# Altium project modFOC-MCU.PrjPcb
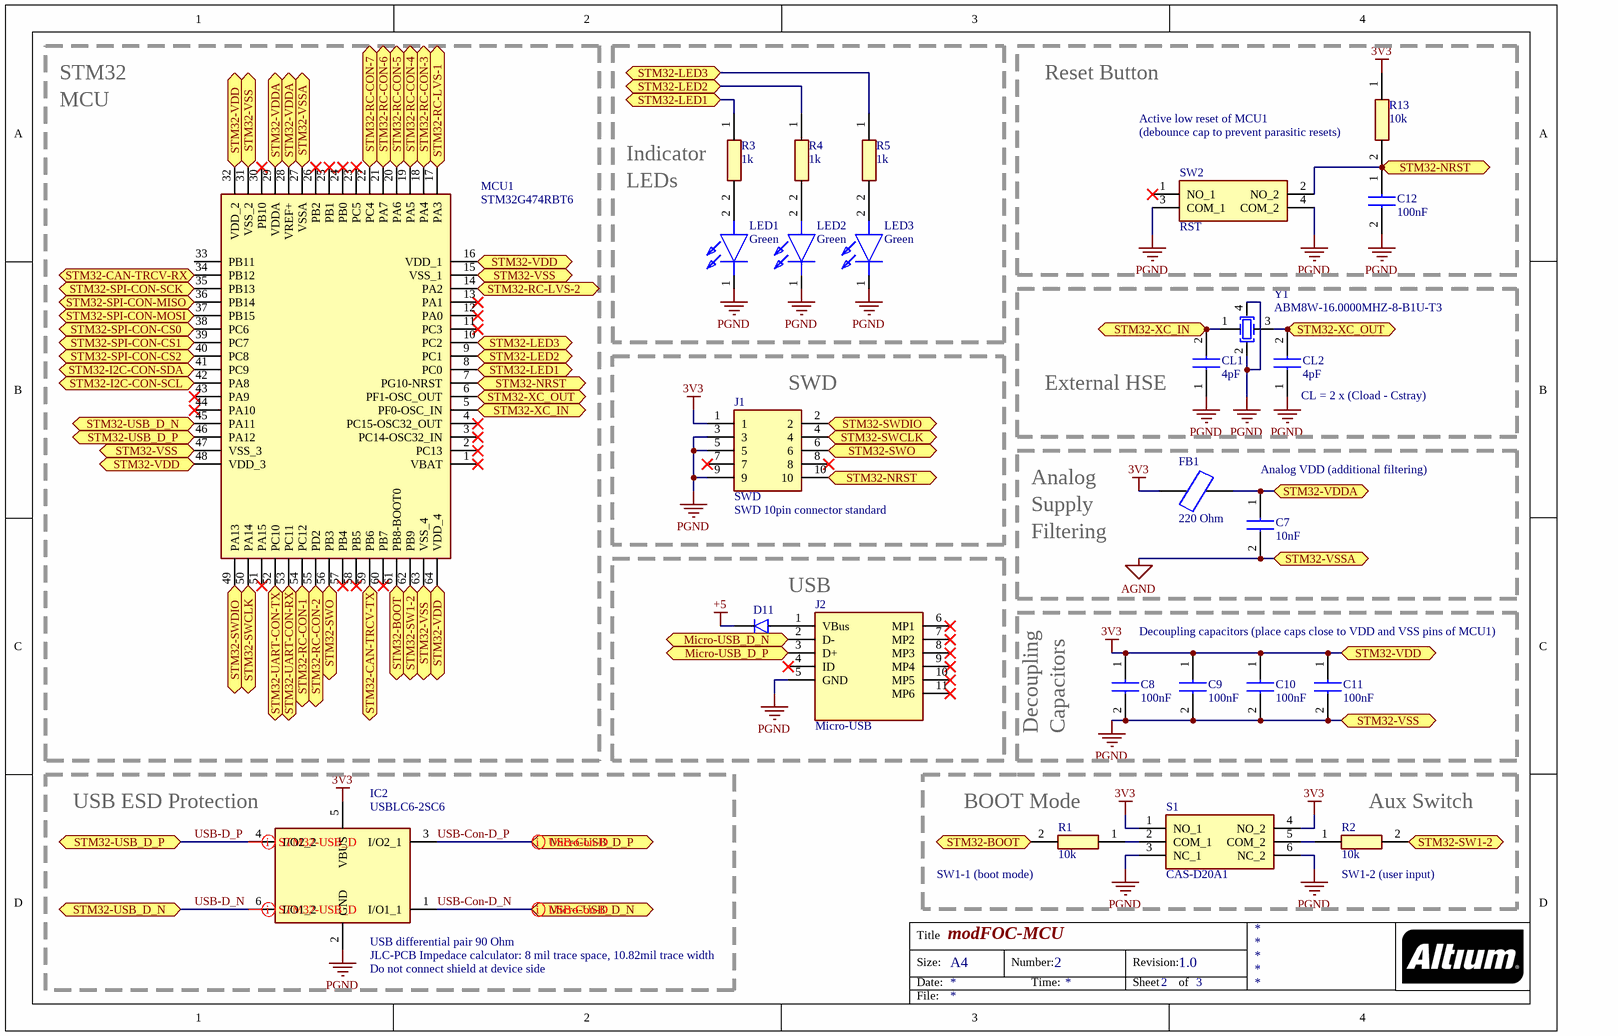
[diagram p0: modFOC-MCU.SchDoc]
3 sheets, 54 parts. Net scope: flat (ports and power ports of the same name join across sheets).
Board file: modFOC-MCU.PcbDoc
Sheets:
  modFOC-MCU.SchDoc
  modFOC-Power_Module.SchDoc
  modFOC-IO.SchDoc

## Sheet modFOC-MCU.SchDoc: modFOC-MCU
size A4; Author: Thomas Hofmann; DocumentNumber: 2; Revision: 1.0; SheetNumber: 2; SheetTotal: 3

### Parts
C7  10nF  [CAPC2012X88N]
C8  100nF  [CAPC1608X97N]
C9  100nF  [CAPC1608X97N]
C10  100nF  [CAPC1608X97N]
C11  100nF  [CAPC1608X97N]
C12  100nF  [CAPC1608X97N]
CL1  4pF  [CAPC1608X90N]
CL2  4pF  [CAPC1608X90N]
D11  BAS3010A03WE6327HTSA1  [SOD2513X110N]  (value not drawn)
FB1  220 Ohm  [BEADC1608X75N]
IC2  USBLC6-2SC6  [SOT95P280X145-6N]
J1  SWD  [HUSSP10W40P127_2X5_635X340X420P]
J2  Micro-USB  [19815841]
LED1  Green  [LGQ396PS35]
LED2  Green  [LGQ396PS35]
LED3  Green  [LGQ396PS35]
MCU1  STM32G474RBT6  [QFP50P1200X1200X160-64N]
R1  10k  [RESC1608X55N]
R2  10k  [RESC1608X55N]
R3  1k  [RESC1608X55N]
R4  1k  [RESC1608X55N]
R5  1k  [RESC1608X55N]
R13  10k  [RESC1608X55N]
S1  CAS-D20A1  [CASD20A1]
SW2  RST  [PTS647SK38SMTR2LFS]
Y1  ABM8W-16.0000MHZ-8-B1U-T3  [ABM8W160000MHZ8B1UT3]

### Blocks framed on the sheet
Reset Button: C12 R13 SW2
External HSE: CL1 CL2 Y1
SWD: J1
USB: D11 J2
USB ESD Protection: IC2

### Ports
Micro-USB_D_N (bidir), Micro-USB_D_P (bidir), STM32-BOOT (bidir), STM32-CAN-TRCV-RX (bidir), STM32-CAN-TRCV-TX (bidir), STM32-I2C-CON-SCL (bidir), STM32-I2C-CON-SDA (bidir), STM32-LED1 (bidir), STM32-LED2 (bidir), STM32-LED3 (bidir), STM32-NRST (bidir), STM32-RC-CON-1 (bidir), STM32-RC-CON-2 (bidir), STM32-RC-CON-3 (bidir), STM32-RC-CON-4 (bidir), STM32-RC-CON-5 (bidir), STM32-RC-CON-6 (bidir), STM32-RC-CON-7 (bidir), STM32-RC-LVS-1 (bidir), STM32-RC-LVS-2 (bidir), STM32-SPI-CON-CS0 (bidir), STM32-SPI-CON-CS1 (bidir), STM32-SPI-CON-CS2 (bidir), STM32-SPI-CON-MISO (bidir), STM32-SPI-CON-MOSI (bidir), STM32-SPI-CON-SCK (bidir), STM32-SW1-2 (bidir), STM32-SWCLK (bidir), STM32-SWDIO (bidir), STM32-SWO (bidir), STM32-UART-CON-RX (bidir), STM32-UART-CON-TX (bidir), STM32-USB_D_N (bidir), STM32-USB_D_P (bidir), STM32-VDD (bidir), STM32-VDDA (bidir), STM32-VSS (bidir), STM32-VSSA (bidir), STM32-XC_IN (bidir), STM32-XC_OUT (bidir)

### Nets
3V3: C8.1 C9.1 C10.1 C11.1 FB1.1 IC2.5(VBUS) J1.1 MCU1.16(VDD_1) MCU1.32(VDD_2) MCU1.48(VDD_3) MCU1.64(VDD_4) R13.1 S1.1(NO_1) S1.4(NO_2) ; port STM32-VDD
+5: D11.1(K)
AGND: C7.2 MCU1.27(VSSA) ; port STM32-VSSA
PGND: C8.2 C9.2 C10.2 C11.2 C12.2 CL1.1 CL2.1 IC2.2(GND) J1.3 J1.5 J1.9 J2.5(GND) LED1.1(K) LED2.1(K) LED3.1(K) MCU1.15(VSS_1) MCU1.31(VSS_2) MCU1.47(VSS_3) MCU1.63(VSS_4) S1.3(NC_1) S1.6(NC_2) SW2.3(COM_1) SW2.4(COM_2) Y1.2(OSC2) Y1.4 ; port STM32-VSS
STM32-BOOT: MCU1.61(PB8-BOOT0) R1.2 ; port STM32-BOOT
STM32-CAN-TRCV-RX: MCU1.34(PB12) ; port STM32-CAN-TRCV-RX
STM32-CAN-TRCV-TX: MCU1.59(PB6) ; port STM32-CAN-TRCV-TX
STM32-I2C-CON-SCL: MCU1.42(PA8) ; port STM32-I2C-CON-SCL
STM32-I2C-CON-SDA: MCU1.41(PC9) ; port STM32-I2C-CON-SDA
STM32-LED1: MCU1.8(PC0) R3.1 ; port STM32-LED1
STM32-LED2: MCU1.9(PC1) R4.1 ; port STM32-LED2
STM32-LED3: MCU1.10(PC2) R5.1 ; port STM32-LED3
STM32-NRST: C12.1 J1.10 MCU1.7(PG10-NRST) R13.2 SW2.2(NO_2) ; port STM32-NRST
STM32-RC-CON-1: MCU1.54(PC12) ; port STM32-RC-CON-1
STM32-RC-CON-2: MCU1.55(PD2) ; port STM32-RC-CON-2
STM32-RC-CON-3: MCU1.18(PA4) ; port STM32-RC-CON-3
STM32-RC-CON-4: MCU1.19(PA5) ; port STM32-RC-CON-4
STM32-RC-CON-5: MCU1.20(PA6) ; port STM32-RC-CON-5
STM32-RC-CON-6: MCU1.21(PA7) ; port STM32-RC-CON-6
STM32-RC-CON-7: MCU1.22(PC4) ; port STM32-RC-CON-7
STM32-RC-LVS-1: MCU1.17(PA3) ; port STM32-RC-LVS-1
STM32-RC-LVS-2: MCU1.14(PA2) ; port STM32-RC-LVS-2
STM32-SPI-CON-CS0: MCU1.38(PC6) ; port STM32-SPI-CON-CS0
STM32-SPI-CON-CS1: MCU1.39(PC7) ; port STM32-SPI-CON-CS1
STM32-SPI-CON-CS2: MCU1.40(PC8) ; port STM32-SPI-CON-CS2
STM32-SPI-CON-MISO: MCU1.36(PB14) ; port STM32-SPI-CON-MISO
STM32-SPI-CON-MOSI: MCU1.37(PB15) ; port STM32-SPI-CON-MOSI
STM32-SPI-CON-SCK: MCU1.35(PB13) ; port STM32-SPI-CON-SCK
STM32-SW1-2: MCU1.62(PB9) R2.2 ; port STM32-SW1-2
STM32-SWCLK: J1.4 MCU1.50(PA14) ; port STM32-SWCLK
STM32-SWDIO: J1.2 MCU1.49(PA13) ; port STM32-SWDIO
STM32-SWO: J1.6 MCU1.56(PB3) ; port STM32-SWO
STM32-UART-CON-RX: MCU1.53(PC11) ; port STM32-UART-CON-RX
STM32-UART-CON-TX: MCU1.52(PC10) ; port STM32-UART-CON-TX
STM32-VDDA: C7.1 FB1.2 MCU1.28(VREF+) MCU1.29(VDDA) ; port STM32-VDDA
STM32-XC_IN: CL1.2 MCU1.5(PF0-OSC_IN) Y1.1(OSC1) ; port STM32-XC_IN
STM32-XC_OUT: CL2.2 MCU1.6(PF1-OSC_OUT) Y1.3 ; port STM32-XC_OUT
USB-Con-D_N: IC2.1(I/O1_1) J2.2(D-) ; port Micro-USB_D_N
USB-Con-D_P: IC2.3(I/O2_1) J2.3(D+) ; port Micro-USB_D_P
USB-D_N: IC2.6(I/O1_2) MCU1.45(PA11) ; port STM32-USB_D_N
USB-D_P: IC2.4(I/O2_2) MCU1.46(PA12) ; port STM32-USB_D_P
NetD11_2: D11.2(A) J2.1(VBus)
NetLED1_2: LED1.2(A) R3.2
NetLED2_2: LED2.2(A) R4.2
NetLED3_2: LED3.2(A) R5.2
NetR1_1: R1.1 S1.2(COM_1)
NetR2_1: R2.1 S1.5(COM_2)

Not connected (* = marked no-connect by the designer): J1 7* 8*; J2 4(ID)* 6(MP1)* 7(MP2)* 8(MP3)* 9(MP4)* 10(MP5)* 11(MP6)*; MCU1 1(VBAT)* 2(PC13)* 3(PC14-OSC32_IN)* 4(PC15-OSC32_OUT)* 11(PC3)* 12(PA0)* 13(PA1)* 23(PC5)* 24(PB0)* 25(PB1)* 26(PB2)* 30(PB10)* 33(PB11) 43(PA9)* 44(PA10)* 51(PA15)* 57(PB4)* 58(PB5)* 60(PB7)*; SW2 1(NO_1)*

### Layout directives
differential pair; rule Differential Pairs Routing [Pref Gap = 10mil    Min Gap  = 8mil    Max Gap  = 10milPref Width = 15mil    Min Width  = 10.28mil    Max Width  = 15mil]: USB-Con-D_N, USB-Con-D_P, USB-D_N, USB-D_P

### Notes on the sheet
- STM32
- MCU
- (near R3) Indicator
- Active low reset of MCU1
- (near R13) (debounce cap to prevent parasitic resets)
- LEDs
- (near CL2) CL = 2 x (Cload - Cstray)
- (near J1) SWD 10pin connector standard
- Analog
- Supply
- Analog VDD (additional filtering)
- Filtering
- Decoupling capacitors (place caps close to VDD and VSS pins of MCU1)
- Decoupling
- Capacitors
- (near R1) BOOT Mode
- (near R2) Aux Switch
- (near R1) SW1-1 (boot mode)
- (near R2) SW1-2 (user input)
- (near IC2) USB differential pair 90 Ohm
- (near IC2) JLC-PCB Impedace calculator: 8 mil trace space, 10.82mil trace width
- (near IC2) Do not connect shield at device side
- Title
- Size:
- Date:
- A4
- Number:
- Time:
- Revision:
- Sheet
- of
- File:

### Library data of the parts
C7 = C0805C103J3GACTU: Capacitor; Manufacturer_Name: Kemet; Datasheet Link: https://componentsearchengine.com/Datasheets/2/C0805C103J3GACTU.pdf; Height: 0.88mm; Manufacturer_Part_Number: C0805C103J3GACTU; Arrow Part Number: C0805C103J3GACTU; Arrow Price/Stock: https://www.arrow.com/en/products/c0805c103j3gactu/kemet-corporation; Mouser Part Number: 80-C0805C103J3G; Mouser Price/Stock: https://www.mouser.co.uk/ProductDetail/KEMET/C0805C103J3GACTU?qs=K%2Fj%2Fqf%252B0fqJFcB%2FiaHub0Q%3D%3D
C8-C12 = VJ0603Y104JXJAC: Capacitor; Manufacturer_Name: Vishay; Datasheet Link: http://www.vishay.com/docs/45226/vj31xrohsautomlcc.pdf; Height: 0.97mm; Manufacturer_Part_Number: VJ0603Y104JXJAC; Mouser Part Number: 77-VJ0603Y104JXJAC; Mouser Price/Stock: https://www.mouser.com/Search/Refine.aspx?Keyword=77-VJ0603Y104JXJAC
CL1 CL2 = CL10C040CB8NNNC: Capacitor; Manufacturer_Name: Samsung Electro-Mechanics; Datasheet Link: https://datasheet.lcsc.com/szlcsc/Samsung-Electro-Mechanics-CL10C040CB8NNNC_C307494.pdf; Height: 0.9mm; Manufacturer_Part_Number: CL10C040CB8NNNC; Mouser Part Number: N/A; Mouser Price/Stock: https://www.mouser.co.uk/ProductDetail/Samsung-Electro-Mechanics/CL10C040CB8NNNC?qs=X6jEic%2FHinCXvSxHicvHqA%3D%3D; Arrow Part Number: CL10C040CB8NNNC; Arrow Price/Stock: https://www.arrow.com/en/products/cl10c040cb8nnnc/samsung-electro-mechanics
D11 = BAS3010A03WE6327HTSA1: Diode; Manufacturer_Name: Infineon; Datasheet Link: https://www.infineon.com/dgdl/Infineon-BAS3010ASERIES-DS-v01_01-en.pdf?fileId=db3a30431ddc9372011dfbc50f231c06; Height: 1.1mm; Manufacturer_Part_Number: BAS3010A03WE6327HTSA1; Arrow Part Number: BAS3010A03WE6327HTSA1; Arrow Price/Stock: https://www.arrow.com/en/products/bas3010a03we6327htsa1/infineon-technologies-ag; Mouser Part Number: 726-BAS3010A-03WE6; Mouser Price/Stock: https://www.mouser.co.uk/ProductDetail/Infineon-Technologies/BAS3010A03WE6327HTSA1?qs=K00xGehIljtEbk1%252B2pLZ%252BQ%3D%3D
FB1 = MPZ1608S221ATA00: Ferrite Bead; Manufacturer_Name: TDK; Datasheet Link: https://product.tdk.com/info/en/catalog/datasheets/beads_commercial_power_mpz1608_en.pdf; Height: 0.75mm; Manufacturer_Part_Number: MPZ1608S221ATA00; Mouser Part Number: 810-MPZ1608S221ATA00; Mouser Price/Stock: https://www.mouser.co.uk/ProductDetail/TDK/MPZ1608S221ATA00/?qs=pLY5GE0xrmLZeKkazChaNg%3D%3D; Arrow Part Number: MPZ1608S221ATA00; Arrow Price/Stock: https://www.arrow.com/en/products/mpz1608s221ata00/tdk
IC2 = USBLC6-2SC6: Integrated Circuit; Manufacturer_Name: STMicroelectronics; Datasheet Link: http://www.st.com/st-web-ui/static/active/en/resource/technical/document/datasheet/CD00050750.pdf; Height: 1.45mm; Manufacturer_Part_Number: USBLC6-2SC6; Arrow Part Number: USBLC6-2SC6; Arrow Price/Stock: https://www.arrow.com/en/products/usblc6-2sc6/stmicroelectronics; Mouser Part Number: 511-USBLC6-2SC6; Mouser Price/Stock: https://www.mouser.co.uk/ProductDetail/STMicroelectronics/USBLC6-2SC6?qs=po45yt2pPpu%2FhNIlwQdTlg%3D%3D
J1 = M50-3600542R: Connector; Manufacturer_Name: Harwin; Datasheet Link: https://cdn.harwin.com/pdfs/M50-360R.pdf; Manufacturer_Part_Number: M50-3600542R; Mouser Part Number: 855-M50-3600542R; Mouser Price/Stock: https://www.mouser.co.uk/ProductDetail/Harwin/M50-3600542R?qs=DVxm2sPGGrrPu%2FxuhpV3yw%3D%3D
J2 = 1981584-1: Connector; Manufacturer_Name: TE Connectivity; Datasheet Link: http://www.te.com/commerce/DocumentDelivery/DDEController?Action=showdoc&DocId=Customer+Drawing%7F1981584%7FD2%7Fpdf%7FEnglish%7FENG_CD_1981584_D2.pdf%7F1981584-1; Height: 3mm; Manufacturer_Part_Number: 1981584-1; Arrow Part Number: 1981584-1; Arrow Price/Stock: https://www.arrow.com/en/products/1981584-1/te-connectivity; Mouser Part Number: 571-1981584-1; Mouser Price/Stock: https://www.mouser.co.uk/ProductDetail/TE-Connectivity/1981584-1?qs=ozkTL%2FUej0TLYxjQLPnd2Q%3D%3D
LED1-LED3 = LG_Q396-PS-35: LED; Manufacturer_Name: OSRAM; Manufacturer_Part_Number: LG Q396-PS-35; Datasheet Link: https://mouser.componentsearchengine.com/Datasheets/2/LG%20Q396-PS-35.pdf; Height: 0.4mm; Arrow Part Number: LG Q396-PS-35; Arrow Price/Stock: https://www.arrow.com/en/products/lgq396-ps-35/osram-opto-semiconductors; Mouser Part Number: 720-LGQ396A3964; Mouser Price/Stock: https://www.mouser.co.uk/ProductDetail/OSRAM-Opto-Semiconductors/LG-Q396-PS-35?qs=xC%252BE9h5iuX5%252BCocujXxOpw%3D%3D
MCU1 = STM32G474RBT6: Integrated Circuit; Manufacturer_Name: STMicroelectronics; Datasheet Link: https://www.mouser.com/datasheet/2/389/stm32g474cb-1600828.pdf; Height: 1.6mm; Manufacturer_Part_Number: STM32G474RBT6; Mouser Part Number: 511-STM32G474RBT6; Mouser Price/Stock: https://www.mouser.co.uk/ProductDetail/STMicroelectronics/STM32G474RBT6?qs=uwxL4vQweFP0uAZUZXLBhQ%3D%3D
R1 R2 R13 = MCT06030C1002FP500: Resistor; Manufacturer_Name: Vishay; Datasheet Link: http://www.vishay.com/docs/28705/mcx0x0xpro.pdf; Height: 0.55mm; Manufacturer_Part_Number: MCT06030C1002FP500; Mouser Part Number: 594-MCT06030C1002FP5; Mouser Price/Stock: https://www.mouser.co.uk/ProductDetail/Vishay-Beyschlag/MCT06030C1002FP500?qs=Wvg1umJc15zoHgIjwqoGHw%3D%3D
R3-R5 = MCT06030C1001FP500: Resistor; Manufacturer_Name: Vishay; Datasheet Link: http://www.vishay.com/docs/28705/mcx0x0xpro.pdf; Height: 0.55mm; Manufacturer_Part_Number: MCT06030C1001FP500; Mouser Part Number: 594-MCT06030C1001FP5; Mouser Price/Stock: https://www.mouser.co.uk/ProductDetail/Vishay-Beyschlag/MCT06030C1001FP500?qs=7ZE6F4QMOBbsjeUdqW8cwA%3D%3D
S1 = CAS-D20A1: Switch; Manufacturer_Name: Copal Electronics; Datasheet Link: https://www.nidec-copal-electronics.com/e/catalog/switch/cas.pdf; Height: 2.5mm; Manufacturer_Part_Number: CAS-D20A1
SW2 = PTS_647_SK38_SMTR2_LFS: Switch; Manufacturer_Name: C & K COMPONENTS; Manufacturer_Part_Number: PTS 647 SK38 SMTR2 LFS; Datasheet Link: https://dznh3ojzb2azq.cloudfront.net/products/Tactile/PTS647/documents/datasheet.pdf; Height: 3.8mm; Arrow Part Number: PTS 647 SK38 SMTR2 LFS; Arrow Price/Stock: https://www.arrow.com/en/products/pts-647-sk38-smtr2-lfs/ck
Y1 = ABM8W-16.0000MHZ-8-B1U-T3: Crystal or Oscillator; Manufacturer_Name: ABRACON; Datasheet Link: https://abracon.com/Resonators/ABM8W.pdf; Height: 0.75mm; Manufacturer_Part_Number: ABM8W-16.0000MHZ-8-B1U-T3; Mouser Part Number: 815-8W16-8B1UT; Mouser Price/Stock: https://www.mouser.co.uk/ProductDetail/ABRACON/ABM8W-160000MHZ-8-B1U-T3?qs=5aG0NVq1C4zuwTHNFUIcqw%3D%3D; Arrow Part Number: ABM8W-16.0000MHZ-8-B1U-T3; Arrow Price/Stock: https://www.arrow.com/en/products/abm8w-16.0000mhz-8-b1u-t3/abracon

## Sheet modFOC-Power_Module.SchDoc: modFOC-Power_Module
size A4; Author: Thomas Hofmann; Organization: HTL St. Pölten; Address1: Thomas Hofmann; DocumentNumber: 1; Revision: 1.0; SheetNumber: 1; SheetTotal: 3
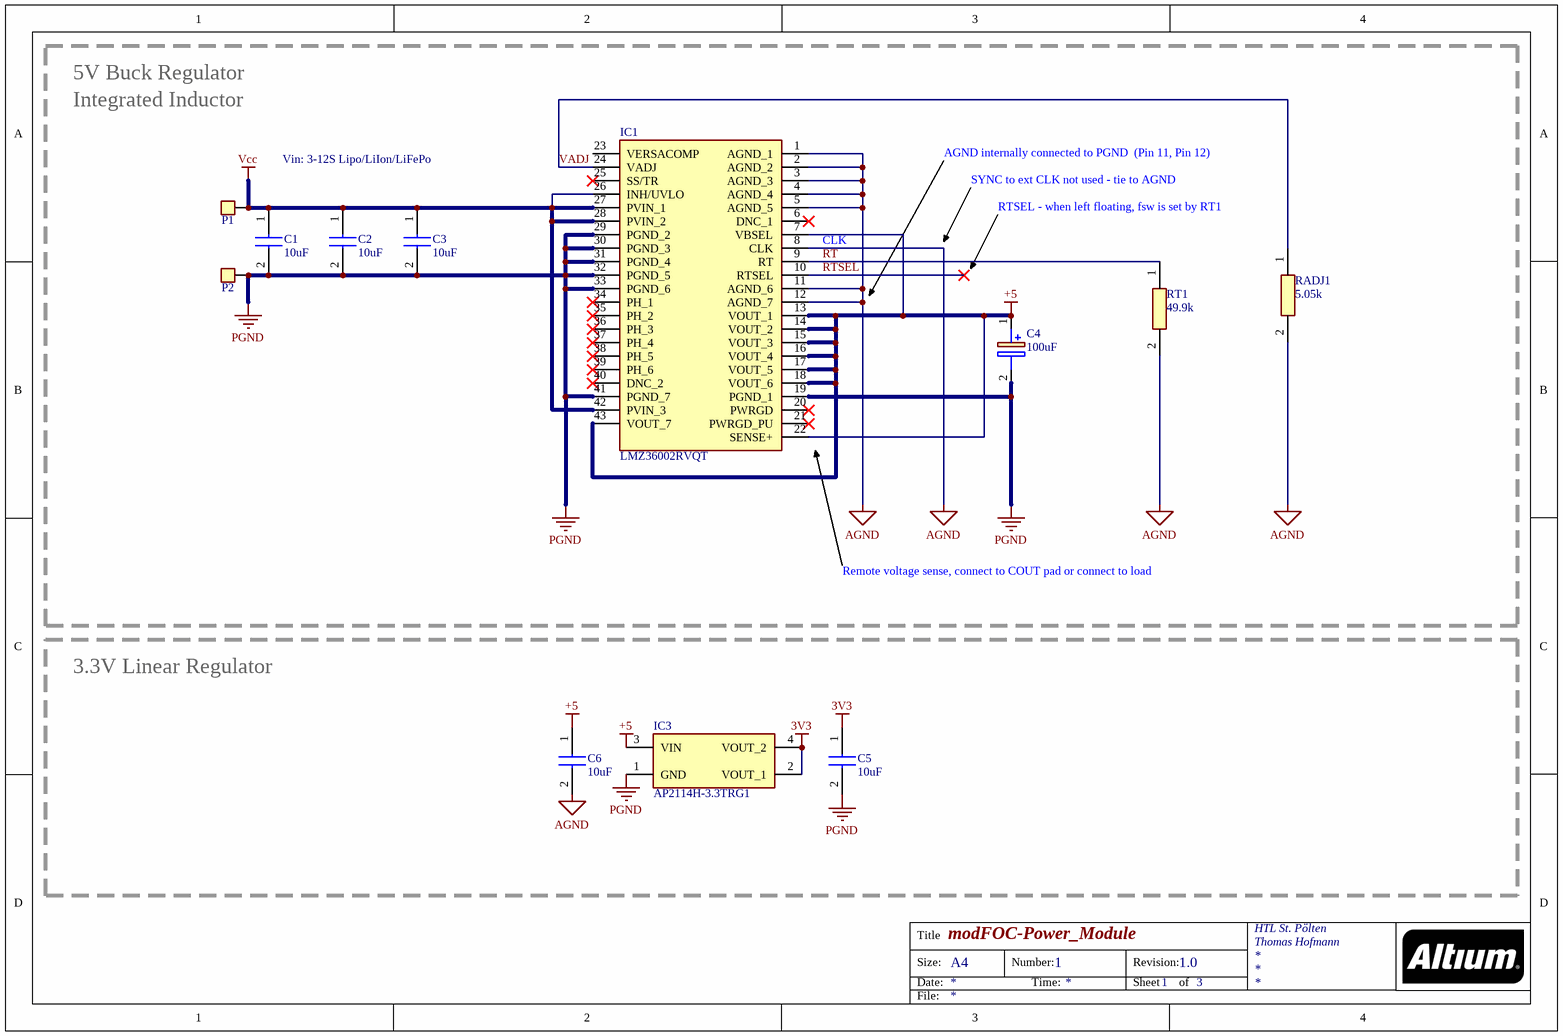
[diagram p1: modFOC-Power_Module.SchDoc]

### Parts
C1  10uF  [CAPC3225X280N]
C2  10uF  [CAPC3225X280N]
C3  10uF  [CAPC3225X280N]
C4  100uF  [CAPPM3528X200N]
C5  10uF  [CAPC3225X280N]
C6  10uF  [CAPC3225X280N]
IC1  LMZ36002RVQT  [LMZ36002RVQR]
IC3  AP2114H-3.3TRG1  [SOT230P700X180-4N]
P1  PowerPad  [POWER_PAD_S]  (value not drawn)
P2  PowerPad  [POWER_PAD_S]  (value not drawn)
RADJ1  5.05k  [R0805]
RT1  49.9k  [R0805]

### Blocks framed on the sheet
3.3V Linear Regulator: C5 C6 IC3

### Nets
3V3: C5.1 IC3.2(VOUT_1) IC3.4(VOUT_2)
+5: C4.1(+) C6.1 IC1.7(VBSEL) IC1.13(VOUT_1) IC1.14(VOUT_2) IC1.15(VOUT_3) IC1.16(VOUT_4) IC1.17(VOUT_5) IC1.18(VOUT_6) IC1.22(SENSE+) IC1.43(VOUT_7) IC3.3(VIN)
AGND: C6.2 IC1.1(AGND_1) IC1.2(AGND_2) IC1.3(AGND_3) IC1.4(AGND_4) IC1.5(AGND_5) IC1.8(CLK) IC1.11(AGND_6) IC1.12(AGND_7) RADJ1.2 RT1.2
PGND: C1.2 C2.2 C3.2 C4.2(-) C5.2 IC1.19(PGND_1) IC1.29(PGND_2) IC1.30(PGND_3) IC1.31(PGND_4) IC1.32(PGND_5) IC1.33(PGND_6) IC1.41(PGND_7) IC3.1(GND) P2.1
Vcc: C1.1 C2.1 C3.1 IC1.26(INH/UVLO) IC1.27(PVIN_1) IC1.28(PVIN_2) IC1.42(PVIN_3) P1.1
RT: IC1.9(RT) RT1.1
RTSEL: IC1.10(RTSEL)
VADJ: IC1.24(VADJ) RADJ1.1

Not connected (* = marked no-connect by the designer): IC1 6(DNC_1)* 20(PWRGD)* 21(PWRGD_PU)* 23(VERSACOMP) 25(SS/TR)* 34(PH_1)* 35(PH_2)* 36(PH_3)* 37(PH_4)* 38(PH_5)* 39(PH_6)* 40(DNC_2)*

### Notes on the sheet
- 5V Buck Regulator
- Integrated Inductor
- Vin: 3-12S Lipo/LiIon/LiFePo
- AGND internally connected to PGND  (Pin 11, Pin 12)
- (near IC1) CLK
- SYNC to ext CLK not used - tie to AGND
- RTSEL - when left floating, fsw is set by RT1
- Remote voltage sense, connect to COUT pad or connect to load
- Title
- Size:
- Date:
- A4
- Number:
- Time:
- Revision:
- Sheet
- of
- File:

### Library data of the parts
C1-C3 C5 C6 = CL32B106KMVNNWE: Capacitor; Manufacturer_Name: Samsung Electro-Mechanics; Datasheet Link: https://www.arrow.com/en/products/cl32b106kmvnnwe/samsung-electro-mechanics; Height: 2.8mm; Manufacturer_Part_Number: CL32B106KMVNNWE; Arrow Part Number: CL32B106KMVNNWE; Arrow Price/Stock: https://www.arrow.com/en/products/cl32b106kmvnnwe/samsung-electro-mechanics; Mouser Part Number: N/A; Mouser Price/Stock: https://www.mouser.co.uk/ProductDetail/Samsung-Electro-Mechanics/CL32B106KMVNNWE?qs=xZ%2FP%252Ba9zWqaEMBbSgKy8gQ%3D%3D
C4 = 8TPE100MAZB: Capacitor Polarised; Manufacturer_Name: Panasonic; Datasheet Link: http://uk.rs-online.com/web/p/products/7887374; Height: 2mm; Manufacturer_Part_Number: 8TPE100MAZB; Arrow Part Number: 8TPE100MAZB; Arrow Price/Stock: https://www.arrow.com/en/products/8tpe100mazb/panasonic; Mouser Part Number: 667-8TPE100MAZB; Mouser Price/Stock: https://www.mouser.co.uk/ProductDetail/Panasonic/8TPE100MAZB?qs=OE1iw1LrrPHKTwwfsidxgA%3D%3D
IC1 = LMZ36002RVQT: Integrated Circuit; Manufacturer_Name: Texas Instruments; Datasheet Link: http://www.ti.com/lit/gpn/lmz36002; Height: 2.13mm; Manufacturer_Part_Number: LMZ36002RVQT; Arrow Part Number: LMZ36002RVQT; Arrow Price/Stock: https://www.arrow.com/en/products/lmz36002rvqt/texas-instruments; Mouser Part Number: 595-LMZ36002RVQT; Mouser Price/Stock: https://www.mouser.co.uk/ProductDetail/Texas-Instruments/LMZ36002RVQT?qs=kFLL9AfgRSBjXTxBMSjGOw%3D%3D
IC3 = AP2114H-3.3TRG1: Integrated Circuit; Manufacturer_Name: Diodes Inc.; Datasheet Link: http://uk.rs-online.com/web/p/products/8283528; Height: 1.8mm; Manufacturer_Part_Number: AP2114H-3.3TRG1; Arrow Part Number: AP2114H-3.3TRG1; Arrow Price/Stock: https://www.arrow.com/en/products/ap2114h-3.3trg1/diodes-incorporated; Mouser Part Number: 621-AP2114H-3.3TRG1; Mouser Price/Stock: https://www.mouser.co.uk/ProductDetail/Diodes-Incorporated/AP2114H-33TRG1?qs=x6A8l6qLYDDSG%2FfwzcsOhw%3D%3D
RADJ1 = RT0805BRD075K05L: Resistor; Manufacturer_Name: Yageo; Datasheet Link: https://www.mouser.at/datasheet/2/447/PYu-RT_1-to-0.01_RoHS_L_11-1669912.pdf; Height: 0.7mm; Manufacturer_Part_Number: RT0805BRD075K05L; Mouser Part Number: 603-RT0805BRD075K05L; Mouser Price/Stock: https://www.mouser.at/ProductDetail/Yageo/RT0805BRD075K05L?qs=bQfrgN9vNvwObDVrZ%2FDM5w%3D%3D
RT1 = ERJ-6ENF4992V: Resistor; Manufacturer_Name: Panasonic; Datasheet Link: https://industrial.panasonic.com/cdbs/www-data/pdf/RDA0000/AOA0000C84.pdf; Height: 0.7mm; Manufacturer_Part_Number: ERJ-6ENF4992V; Mouser Part Number: 667-ERJ-6ENF4992V; Mouser Price/Stock: https://www.mouser.com/Search/Refine.aspx?Keyword=667-ERJ-6ENF4992V

## Sheet modFOC-IO.SchDoc: modFOC-IO
size A4; Organization: HTL St. Pölten; Address1: Thomas Hofmann; DocumentNumber: 3; Revision: 1.0; SheetNumber: 3; SheetTotal: 3
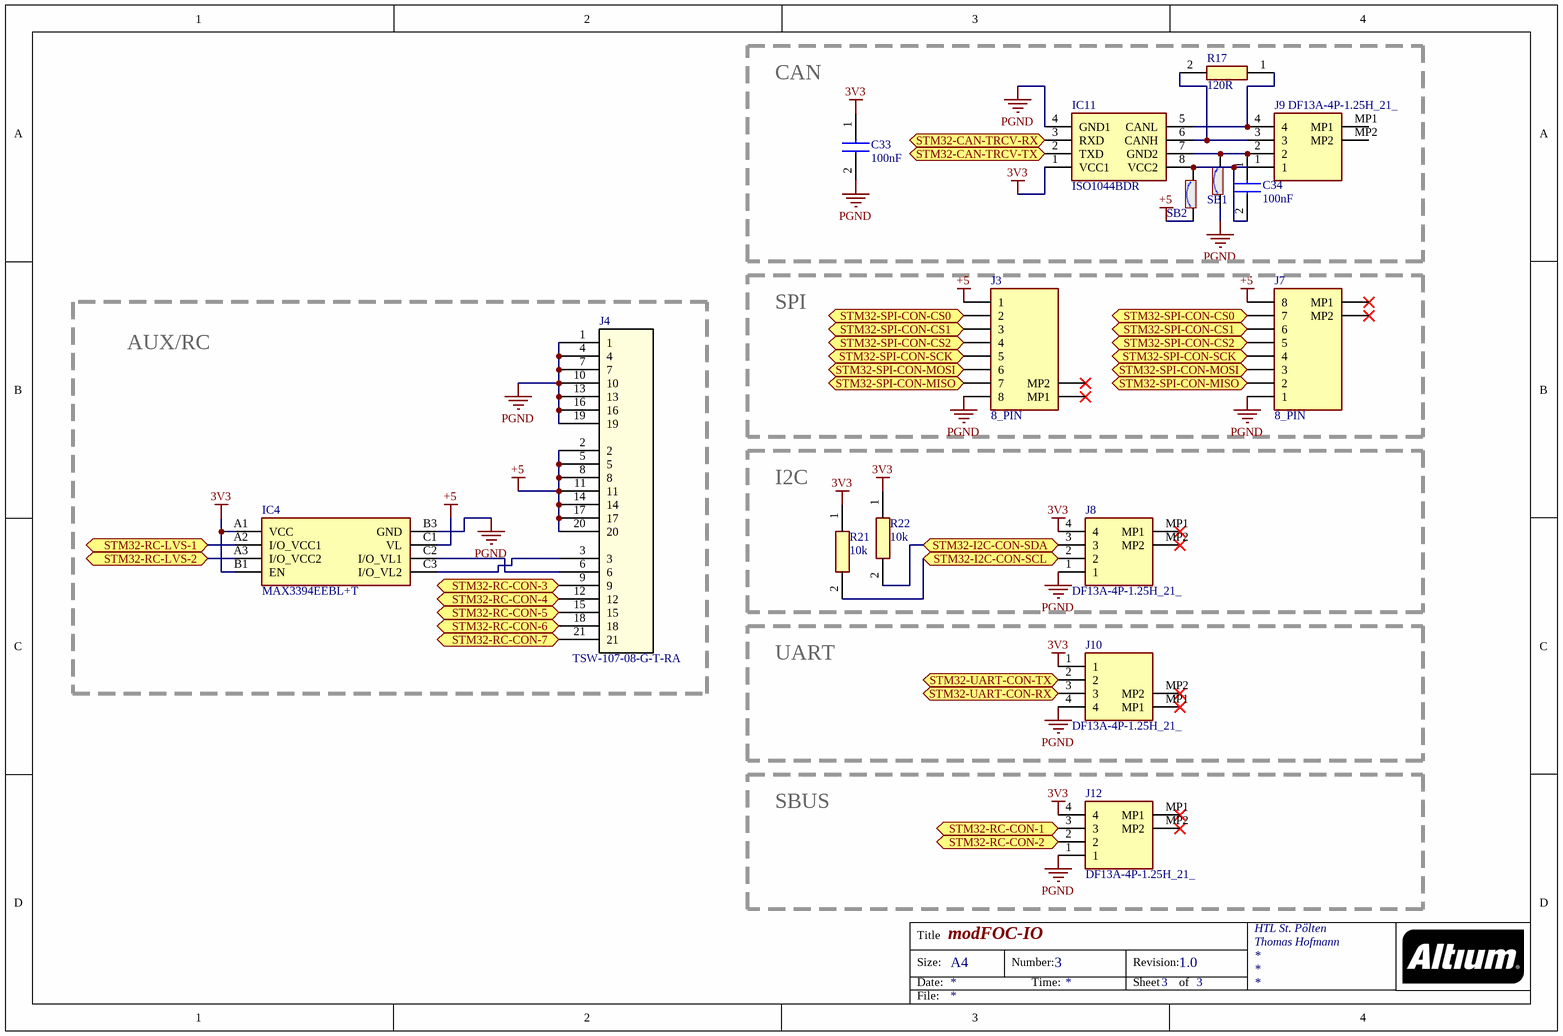
[diagram p2: modFOC-IO.SchDoc]

### Parts
C33  100nF  [CAPC1608X97N]
C34  100nF  [CAPC1608X97N]
IC4  MAX3394EEBL+T  [BGA8C50P3X3_160X160X67]
IC11  ISO1044BDR  [SOIC127P600X175-8N]
J3  8_PIN  [DF13A8P125H21]
J4  TSW-107-08-G-T-RA  [TSW-107-08-T-T-RA_SAI]
J7  8_PIN  [DF13A8P125H21]
J8  DF13A-4P-1.25H_21_  [DF13A4P125H21]
J9  DF13A-4P-1.25H_21_  [DF13A4P125H21]
J10  DF13A-4P-1.25H_21_  [DF13A4P125H21]
J12  DF13A-4P-1.25H_21_  [DF13A4P125H21]
R17  120R  [RESC1608X55N]
R21  10k  [RESC1608X55N]
R22  10k  [RESC1608X55N]
SB1  Solder Bridge  [SOLDER-BRIDGE_R0603-0R]  (value not drawn)
SB2  Solder Bridge  [SOLDER-BRIDGE_R0603-0R]  (value not drawn)

### Blocks framed on the sheet
CAN: C33 C34 IC11 J9 R17 SB1 SB2
AUX/RC: IC4 J4
SPI: J3 J7
I2C: J8 R21 R22
UART: J10
SBUS: J12

### Ports
STM32-CAN-TRCV-RX (bidir), STM32-CAN-TRCV-TX (bidir), STM32-I2C-CON-SCL (bidir), STM32-I2C-CON-SDA (bidir), STM32-RC-CON-1 (bidir), STM32-RC-CON-2 (bidir), STM32-RC-CON-3 (bidir), STM32-RC-CON-4 (bidir), STM32-RC-CON-5 (bidir), STM32-RC-CON-6 (bidir), STM32-RC-CON-7 (bidir), STM32-RC-LVS-1 (bidir), STM32-RC-LVS-2 (bidir), STM32-SPI-CON-CS0 (bidir), STM32-SPI-CON-CS1 (bidir), STM32-SPI-CON-CS2 (bidir), STM32-SPI-CON-MISO (bidir), STM32-SPI-CON-MOSI (bidir), STM32-SPI-CON-SCK (bidir), STM32-UART-CON-RX (bidir), STM32-UART-CON-TX (bidir)

### Nets
3V3: C33.1 IC4.A1(VCC) IC4.B1(EN) IC11.1(VCC1) J8.4 J10.1 J12.4 R21.1 R22.1
+5: IC4.C1(VL) J3.1 J4.2 J4.5 J4.8 J4.11 J4.14 J4.17 J4.20 J7.8 SB2.1
PGND: C33.2 IC4.B3(GND) IC11.4(GND1) J3.8 J4.1 J4.4 J4.7 J4.10 J4.13 J4.16 J4.19 J7.1 J8.1 J10.4 J12.1 SB1.1
STM32-CAN-TRCV-RX: IC11.3(RXD) ; port STM32-CAN-TRCV-RX
STM32-CAN-TRCV-TX: IC11.2(TXD) ; port STM32-CAN-TRCV-TX
STM32-I2C-CON-SCL: J8.2 R21.2 ; port STM32-I2C-CON-SCL
STM32-I2C-CON-SDA: J8.3 R22.2 ; port STM32-I2C-CON-SDA
STM32-RC-CON-1: J12.3 ; port STM32-RC-CON-1
STM32-RC-CON-2: J12.2 ; port STM32-RC-CON-2
STM32-RC-CON-3: J4.9 ; port STM32-RC-CON-3
STM32-RC-CON-4: J4.12 ; port STM32-RC-CON-4
STM32-RC-CON-5: J4.15 ; port STM32-RC-CON-5
STM32-RC-CON-6: J4.18 ; port STM32-RC-CON-6
STM32-RC-CON-7: J4.21 ; port STM32-RC-CON-7
STM32-RC-LVS-1: IC4.A2(I/O_VCC1) ; port STM32-RC-LVS-1
STM32-RC-LVS-2: IC4.A3(I/O_VCC2) ; port STM32-RC-LVS-2
STM32-SPI-CON-CS0: J3.2 J7.7 ; port STM32-SPI-CON-CS0
STM32-SPI-CON-CS1: J3.3 J7.6 ; port STM32-SPI-CON-CS1
STM32-SPI-CON-CS2: J3.4 J7.5 ; port STM32-SPI-CON-CS2
STM32-SPI-CON-MISO: J3.7 J7.2 ; port STM32-SPI-CON-MISO
STM32-SPI-CON-MOSI: J3.6 J7.3 ; port STM32-SPI-CON-MOSI
STM32-SPI-CON-SCK: J3.5 J7.4 ; port STM32-SPI-CON-SCK
STM32-UART-CON-RX: J10.3 ; port STM32-UART-CON-RX
STM32-UART-CON-TX: J10.2 ; port STM32-UART-CON-TX
NetC34_1: C34.1 IC11.7(GND2) J9.2 SB1.2
NetC34_2: C34.2 IC11.8(VCC2) J9.1 SB2.2
NetIC4_C2: IC4.C2(I/O_VL1) J4.6
NetIC4_C3: IC4.C3(I/O_VL2) J4.3
NetIC11_5: IC11.5(CANL) J9.4 R17.1
NetIC11_6: IC11.6(CANH) J9.3 R17.2

Not connected (* = marked no-connect by the designer): J3 MP1* MP2*; J7 MP1* MP2*; J8 MP1* MP2*; J9 MP1 MP2; J10 MP1* MP2*; J12 MP1* MP2*

### Notes on the sheet
- Title
- Size:
- Date:
- A4
- Number:
- Time:
- Revision:
- Sheet
- of
- File:

### Library data of the parts
C33 C34 = VJ0603Y104JXJAC: Capacitor; Manufacturer_Name: Vishay; Datasheet Link: http://www.vishay.com/docs/45226/vj31xrohsautomlcc.pdf; Height: 0.97mm; Manufacturer_Part_Number: VJ0603Y104JXJAC; Mouser Part Number: 77-VJ0603Y104JXJAC; Mouser Price/Stock: https://www.mouser.com/Search/Refine.aspx?Keyword=77-VJ0603Y104JXJAC
IC4 = MAX3394EEBL+T: Integrated Circuit; Manufacturer_Name: Maxim Integrated; Datasheet Link: https://datasheets.maximintegrated.com/en/ds/MAX3394E-MAX3396E.pdf; Height: 0.67mm; Manufacturer_Part_Number: MAX3394EEBL+T; Mouser Part Number: 700-MAX3394EEBLT; Mouser Price/Stock: https://www.mouser.co.uk/ProductDetail/Maxim-Integrated/MAX3394EEBL%2bT?qs=LHmEVA8xxfZSpxRu22m1hw%3D%3D
IC11 = ISO1044BDR: Integrated Circuit; Manufacturer_Name: Texas Instruments; Datasheet Link: http://www.ti.com/lit/gpn/iso1044?HQS=ti-null-null-sf-df-pf-sep-wwe&DCM=yes; Height: 1.75mm; Manufacturer_Part_Number: ISO1044BDR; Mouser Part Number: 595-ISO1044BDR; Mouser Price/Stock: https://www.mouser.co.uk/ProductDetail/Texas-Instruments/ISO1044BDR/?qs=DuoOggApuK9UGD9QQWYeTA%3D%3D
J3 J7 = DF13A-8P-1.25H_21_: Connector; Manufacturer_Name: Hirose; Manufacturer_Part_Number: DF13A-8P-1.25H(21); Datasheet Link: http://uk.rs-online.com/web/p/products/7793617P; Height: 3.6mm; Mouser Part Number: 798-DF13A8P125H21; Mouser Price/Stock: https://www.mouser.co.uk/ProductDetail/Hirose-Connector/DF13A-8P-125H21?qs=XQjbzJWzFPViW0MGk5%2FVbA%3D%3D
J4 = TSW-107-08-G-T-RA: No Description Available; Vendor: Samtec Inc; Built_By: EMA_UL_Team; SourceLibrary: Samtec_2016-10-07_8; Manufacturer_Part_Number: TSW-107-08-G-T-RA; Copyright: Copyright (C) 2018 Accelerated Designs. All rights reserved; RefDes: RefDes; Type: DEV
J8-J10 J12 = DF13A-4P-1.25H_21_: Connector; Manufacturer_Name: Hirose; Manufacturer_Part_Number: DF13A-4P-1.25H(21); Datasheet Link: https://componentsearchengine.com/Datasheets/1/DF13A-4P-1.25H(21).pdf; Height: 3.6mm; Mouser Part Number: 798-DF13A4P125H21; Mouser Price/Stock: https://www.mouser.co.uk/ProductDetail/Hirose-Connector/DF13A-4P-125H21?qs=XQjbzJWzFPXWzMShI70F0w%3D%3D
R17 = ERJPA3J121V: Resistor; Manufacturer_Name: Panasonic; Datasheet Link: https://industrial.panasonic.com/cdbs/www-data/pdf/RDA0000/AOA0000C243.pdf; Height: 0.55mm; Manufacturer_Part_Number: ERJPA3J121V
R21 R22 = MCT06030C1002FP500: Resistor; Manufacturer_Name: Vishay; Datasheet Link: http://www.vishay.com/docs/28705/mcx0x0xpro.pdf; Height: 0.55mm; Manufacturer_Part_Number: MCT06030C1002FP500; Mouser Part Number: 594-MCT06030C1002FP5; Mouser Price/Stock: https://www.mouser.co.uk/ProductDetail/Vishay-Beyschlag/MCT06030C1002FP500?qs=Wvg1umJc15zoHgIjwqoGHw%3D%3D
SB1 SB2 = Solder Bridge: Internal_Part_Number: MCD-00071; Part_Type: Mechanical; Manufacturer_Part_Number: RC0603JR-070RL; Manufacturer: YAGEO; Provided_By: SUBCO; ECCN_US: n/a; ECCN_EU: n/a; Status: Released; Package: SB0603; ComponentLink1Description: Datasheet; ComponentLink1URL: http://tunmcdsvn.tun.st.com/Component_Datasheet_Library/Trunk/Resistors/Yageo_Resistor_RC0603-series

## Nets that join several sheets
3V3: modFOC-MCU (14 pins), modFOC-Power_Module (C5.1 IC3.2 IC3.4), modFOC-IO (9 pins)
+5: modFOC-MCU (D11.1), modFOC-Power_Module (12 pins), modFOC-IO (11 pins)
AGND: modFOC-MCU (C7.2 MCU1.27), modFOC-Power_Module (11 pins)
PGND: modFOC-MCU (25 pins), modFOC-Power_Module (14 pins), modFOC-IO (16 pins)
STM32-CAN-TRCV-RX: modFOC-MCU (MCU1.34), modFOC-IO (IC11.3)
STM32-CAN-TRCV-TX: modFOC-MCU (MCU1.59), modFOC-IO (IC11.2)
STM32-I2C-CON-SCL: modFOC-MCU (MCU1.42), modFOC-IO (J8.2 R21.2)
STM32-I2C-CON-SDA: modFOC-MCU (MCU1.41), modFOC-IO (J8.3 R22.2)
STM32-RC-CON-1: modFOC-MCU (MCU1.54), modFOC-IO (J12.3)
STM32-RC-CON-2: modFOC-MCU (MCU1.55), modFOC-IO (J12.2)
STM32-RC-CON-3: modFOC-MCU (MCU1.18), modFOC-IO (J4.9)
STM32-RC-CON-4: modFOC-MCU (MCU1.19), modFOC-IO (J4.12)
STM32-RC-CON-5: modFOC-MCU (MCU1.20), modFOC-IO (J4.15)
STM32-RC-CON-6: modFOC-MCU (MCU1.21), modFOC-IO (J4.18)
STM32-RC-CON-7: modFOC-MCU (MCU1.22), modFOC-IO (J4.21)
STM32-RC-LVS-1: modFOC-MCU (MCU1.17), modFOC-IO (IC4.A2)
STM32-RC-LVS-2: modFOC-MCU (MCU1.14), modFOC-IO (IC4.A3)
STM32-SPI-CON-CS0: modFOC-MCU (MCU1.38), modFOC-IO (J3.2 J7.7)
STM32-SPI-CON-CS1: modFOC-MCU (MCU1.39), modFOC-IO (J3.3 J7.6)
STM32-SPI-CON-CS2: modFOC-MCU (MCU1.40), modFOC-IO (J3.4 J7.5)
STM32-SPI-CON-MISO: modFOC-MCU (MCU1.36), modFOC-IO (J3.7 J7.2)
STM32-SPI-CON-MOSI: modFOC-MCU (MCU1.37), modFOC-IO (J3.6 J7.3)
STM32-SPI-CON-SCK: modFOC-MCU (MCU1.35), modFOC-IO (J3.5 J7.4)
STM32-UART-CON-RX: modFOC-MCU (MCU1.53), modFOC-IO (J10.3)
STM32-UART-CON-TX: modFOC-MCU (MCU1.52), modFOC-IO (J10.2)